# EAGLE schematic TM_EE Onboarding_BMS System (EAGLE 9.7.0)
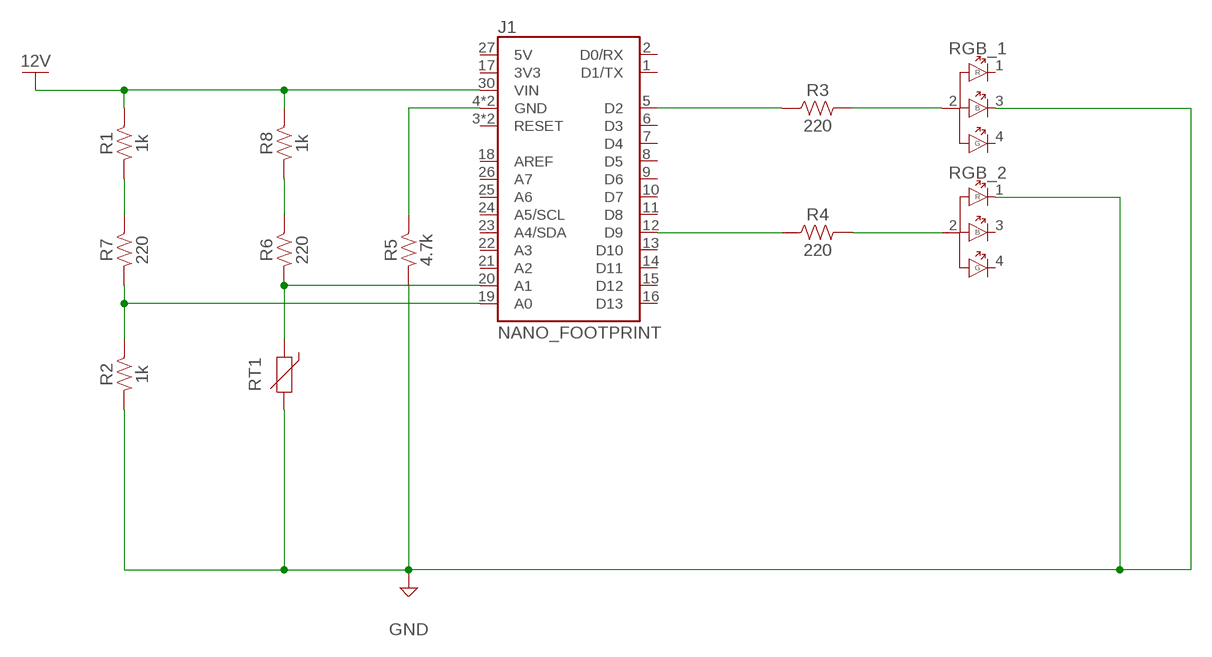
[diagram p0: schematic, sheet 1]

## Parts
J1  NANO_FOOTPRINT  [NANO]
R1  1k  R-US_CHIP-0402(1005-METRIC)  [RESC1005X40]
R2  1k  R-US_CHIP-0402(1005-METRIC)  [RESC1005X40]
R3  220  R-US_CHIP-0402(1005-METRIC)  [RESC1005X40]
R4  220  R-US_CHIP-0402(1005-METRIC)  [RESC1005X40]
R5  4.7k  R-US_CHIP-0402(1005-METRIC)  [RESC1005X40]
R6  220  R-US_CHIP-0402(1005-METRIC)  [RESC1005X40]
R7  220  R-US_CHIP-0402(1005-METRIC)  [RESC1005X40]
R8  1k  R-US_CHIP-0402(1005-METRIC)  [RESC1005X40]
RGB_1  RGB-LED-CA_WP154A4SEJ3VBDZGW/CA_5MM_RADIAL  [LED5MM_RGB]
RGB_2  RGB-LED-CA_WP154A4SEJ3VBDZGW/CA_5MM_RADIAL  [LED5MM_RGB]
RT1  NCP03WB473E05RL_03  [THRMC0603X33]

## Nets
12V: J1.30(VIN) R1.1 R8.1
GND: R2.2 R5.2 RGB_1.3(CBLUE) RGB_2.1(CRED) RT1.2
N$1: J1.19(A0) R2.1 R7.2
N$2: R3.2 RGB_1.2(CA)
N$3: J1.5(D2) R3.1
N$4: J1.12(D9) R4.1
N$5: R4.2 RGB_2.2(CA)
N$6: J1.4(GND) J1.29(GND) R5.1
N$7: R1.2 R7.1
N$8: J1.20(A1) R6.2 RT1.1
N$9: R6.1 R8.2
Unconnected: J1.1(D1/TX) J1.2(D0/RX) J1.3(RESET) J1.6(D3) J1.7(D4) J1.8(D5) J1.9(D6) J1.10(D7) J1.11(D8) J1.13(D10) J1.14(D11) J1.15(D12) J1.16(D13) J1.17(3V3) J1.18(AREF) J1.21(A2) J1.22(A3) J1.23(A4/SDA) J1.24(A5/SCL) J1.25(A6) J1.26(A7) J1.27(5V) J1.28(RESET) RGB_1.1(CRED) RGB_1.4(CGREEN) RGB_2.3(CBLUE) RGB_2.4(CGREEN)

## Library data of the parts
J1 = SparkFun-Boards:NANO_FOOTPRINT: Generic Nano Footprint
R1-R8 = Resistor:R-US: Resistor Fixed - ANSI
RGB_1 = LED:RGB-LED-CA: RGB LED Radial Common Anode; DESCRIPTION: RGB_LED
RGB_2 = LED:RGB-LED-CA: RGB LED Radial Common Anode
RT1 = Sensor:NCP: NTC Thermistor NCP03 NCP15 NCP18 Datasheet <https://www.mouser.in/datasheet/2/281/r44e-522712.pdf>